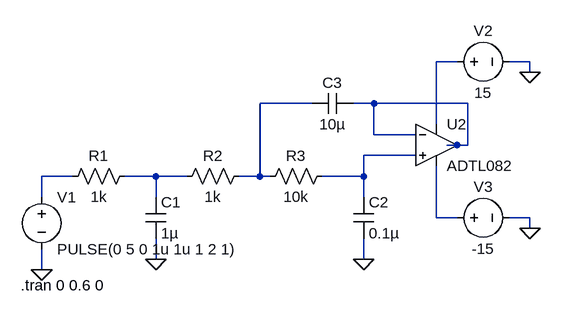
[diagram p0: schematic Circuito4.asc]
Circuito4.asc, the LTspice schematic file:
Version 4.1
SHEET 1 880 680
WIRE 592 -48 560 -48
WIRE 704 -48 672 -48
WIRE 704 -32 704 -48
WIRE 368 16 288 16
WIRE 464 16 432 16
WIRE 608 16 464 16
WIRE 560 48 560 -48
WIRE 464 64 464 16
WIRE 528 64 464 64
WIRE 592 80 576 80
WIRE 608 80 608 16
WIRE 608 80 592 80
WIRE 528 96 448 96
WIRE 0 128 -48 128
WIRE 128 128 80 128
WIRE 176 128 128 128
WIRE 288 128 288 16
WIRE 288 128 256 128
WIRE 304 128 288 128
WIRE 448 128 448 96
WIRE 448 128 384 128
WIRE -48 160 -48 128
WIRE 128 160 128 128
WIRE 448 160 448 128
WIRE 560 192 560 112
WIRE 592 192 560 192
WIRE 704 192 672 192
WIRE 704 208 704 192
WIRE 128 256 128 224
WIRE 448 256 448 224
WIRE -48 272 -48 240
FLAG 128 256 0
FLAG 448 256 0
FLAG -48 272 0
FLAG 704 -32 0
FLAG 704 208 0
SYMBOL res 96 112 R90
WINDOW 0 0 56 VBottom 2
WINDOW 3 32 56 VTop 2
SYMATTR InstName R1
SYMATTR Value 1k
SYMBOL res 272 112 R90
WINDOW 0 0 56 VBottom 2
WINDOW 3 32 56 VTop 2
SYMATTR InstName R2
SYMATTR Value 1k
SYMBOL cap 112 160 R0
SYMATTR InstName C1
SYMATTR Value 1µ
SYMBOL res 400 112 R90
WINDOW 0 0 56 VBottom 2
WINDOW 3 32 56 VTop 2
SYMATTR InstName R3
SYMATTR Value 10k
SYMBOL cap 432 160 R0
SYMATTR InstName C2
SYMATTR Value 0.1µ
SYMBOL cap 432 0 R90
WINDOW 0 0 32 VBottom 2
WINDOW 3 32 32 VTop 2
SYMATTR InstName C3
SYMATTR Value 10µ
SYMBOL voltage -48 144 R0
WINDOW 123 0 0 Left 0
WINDOW 39 0 0 Left 0
SYMATTR InstName V1
SYMATTR Value PULSE(0 5 0 1u 1u 1 2 1)
SYMBOL voltage 576 -48 R270
WINDOW 0 32 56 VTop 2
WINDOW 3 -32 56 VBottom 2
WINDOW 123 0 0 Left 0
WINDOW 39 0 0 Left 0
SYMATTR InstName V2
SYMATTR Value 15
SYMBOL voltage 576 192 R270
WINDOW 0 32 56 VTop 2
WINDOW 3 -32 56 VBottom 2
WINDOW 123 0 0 Left 0
WINDOW 39 0 0 Left 0
SYMATTR InstName V3
SYMATTR Value -15
SYMBOL OpAmps\\ADTL082 560 16 R0
SYMATTR InstName U2
TEXT -80 296 Left 2 !.tran 0 0.6 0

The netlist it stands for:
* Circuito4.asc
R1 N006 N005 1k
R2 N002 N006 1k
C1 N006 0 1µ
R3 N004 N002 10k
C2 N004 0 0.1µ
C3 N003 N002 10µ
V1 N005 0 PULSE(0 5 0 1u 1u 1 2 1)
V2 N001 0 15
V3 N007 0 -15
X§U2 N004 N003 N001 N007 N003 ADTL082  ; pins In+ In- V+ V- OUT
.tran 0 0.6 0
.lib ADI.lib
.backanno
.end